# EAGLE schematic nervous_system (EAGLE 8.4.1)
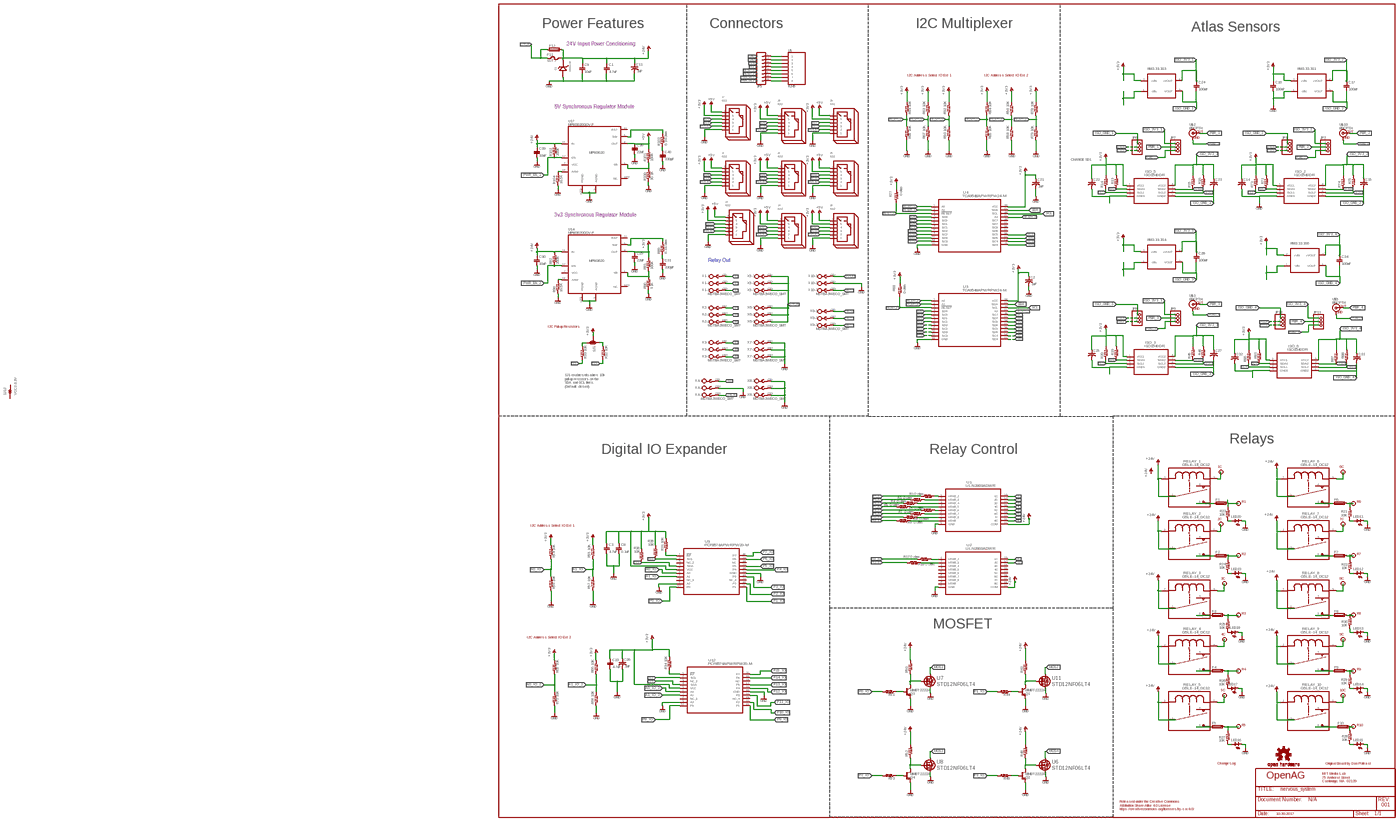
[diagram p0: schematic, sheet 1, overview]
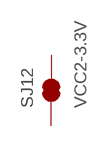
[diagram p1: schematic, sheet 1, part 1 of 5]
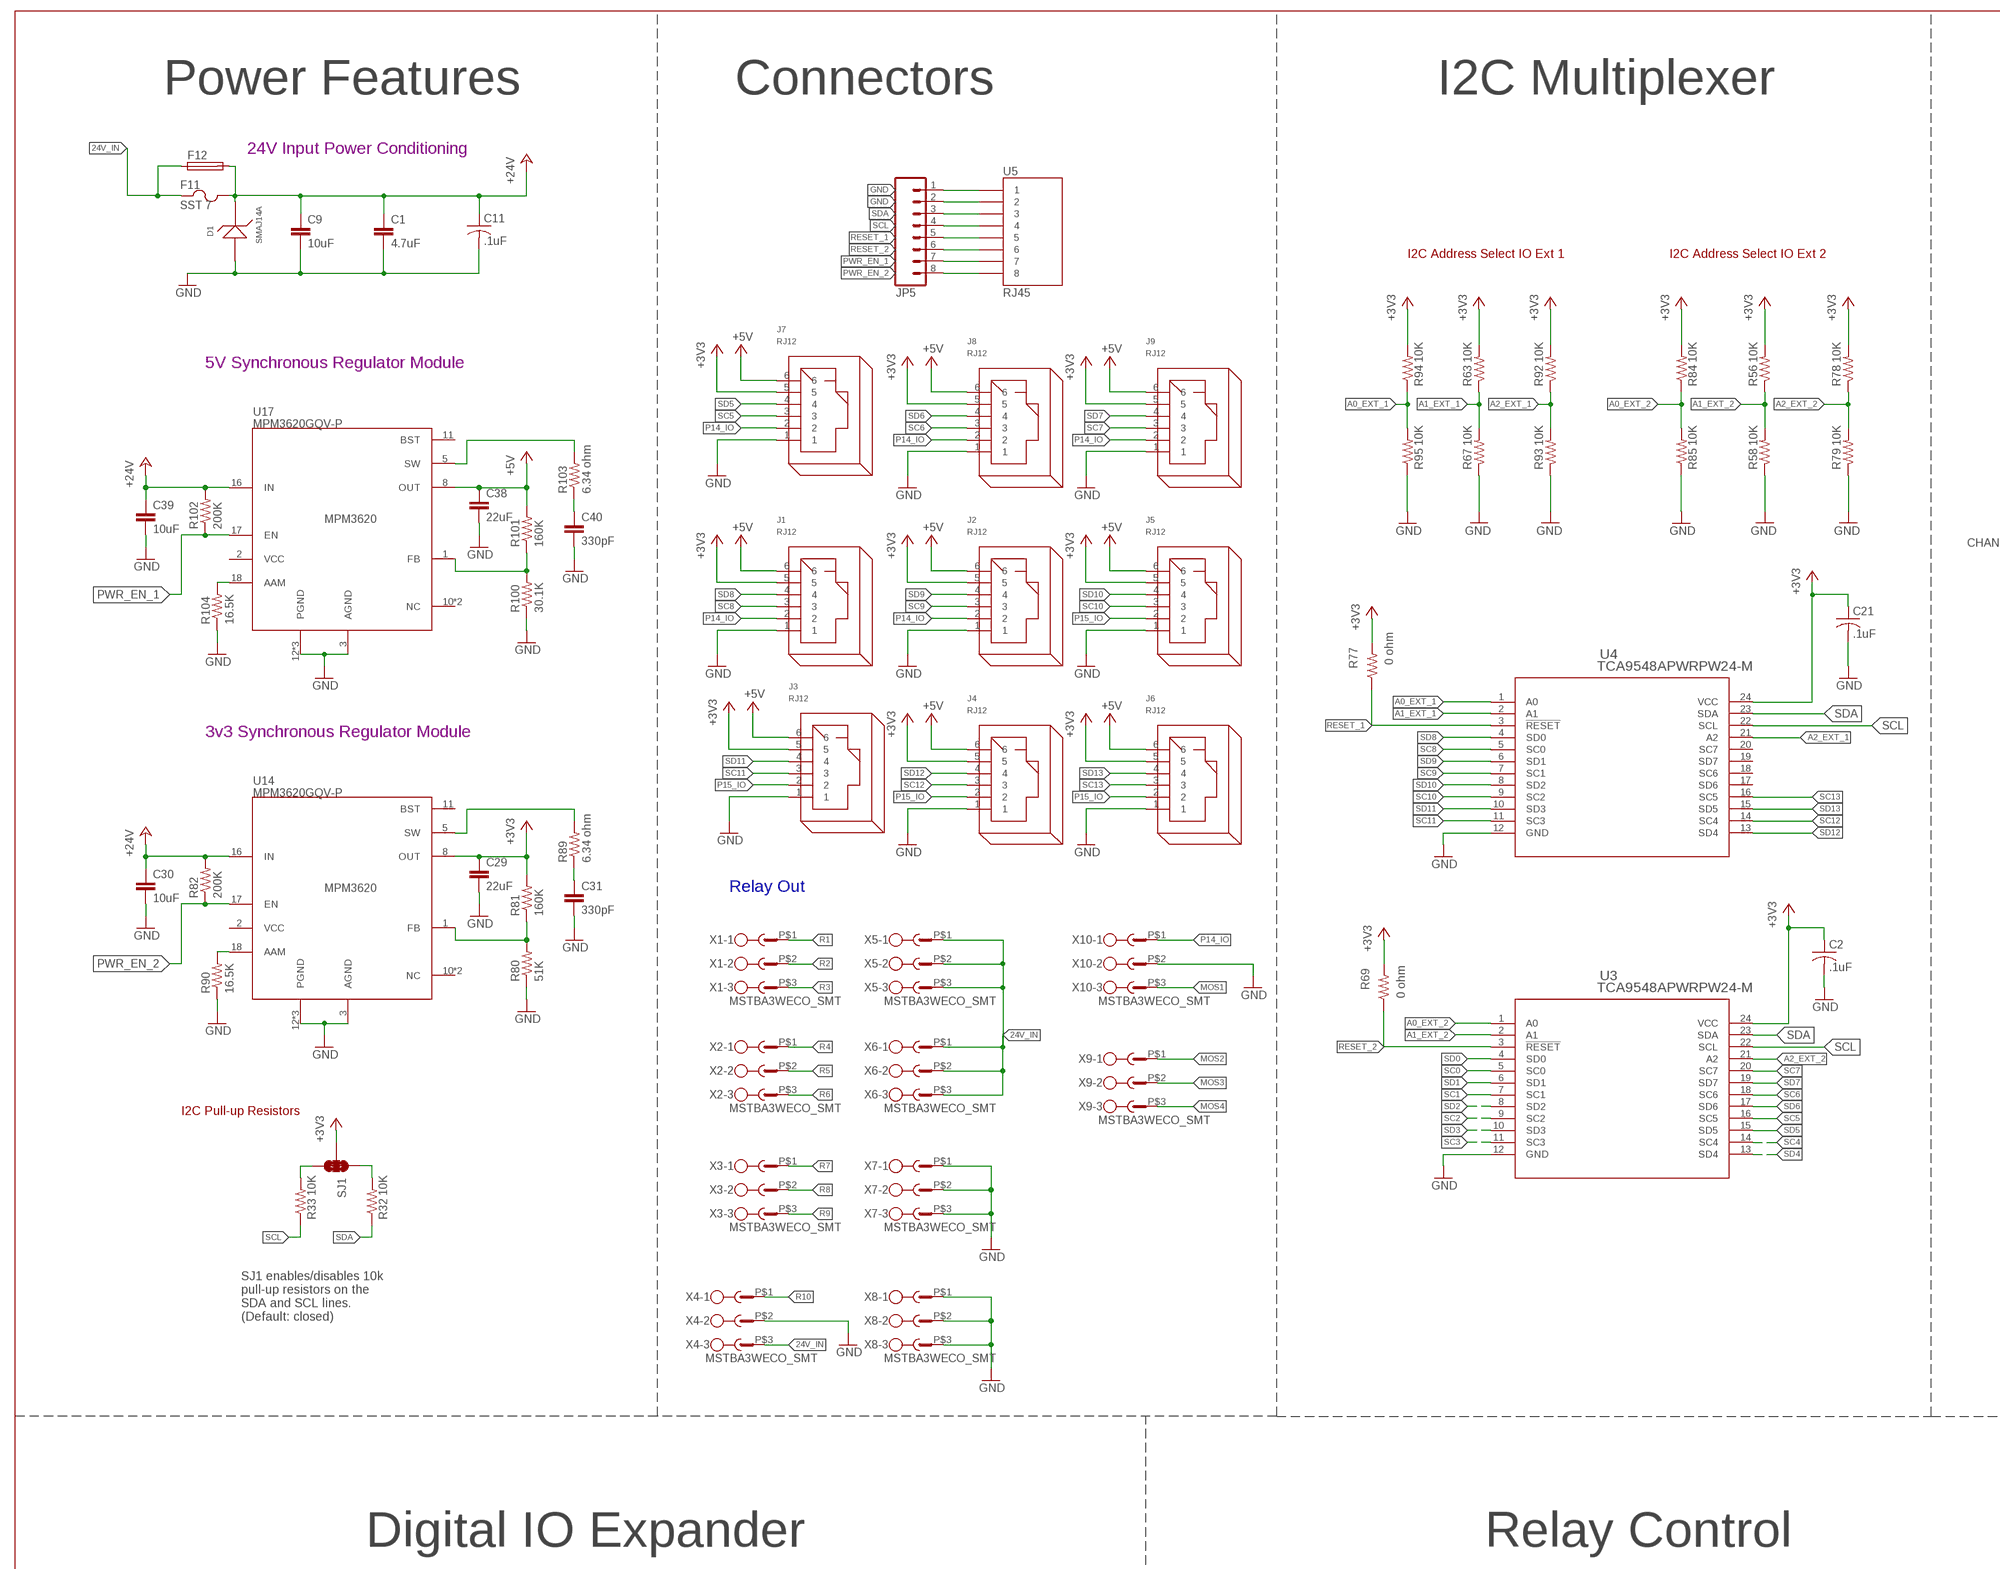
[diagram p2: schematic, sheet 1, part 2 of 5]
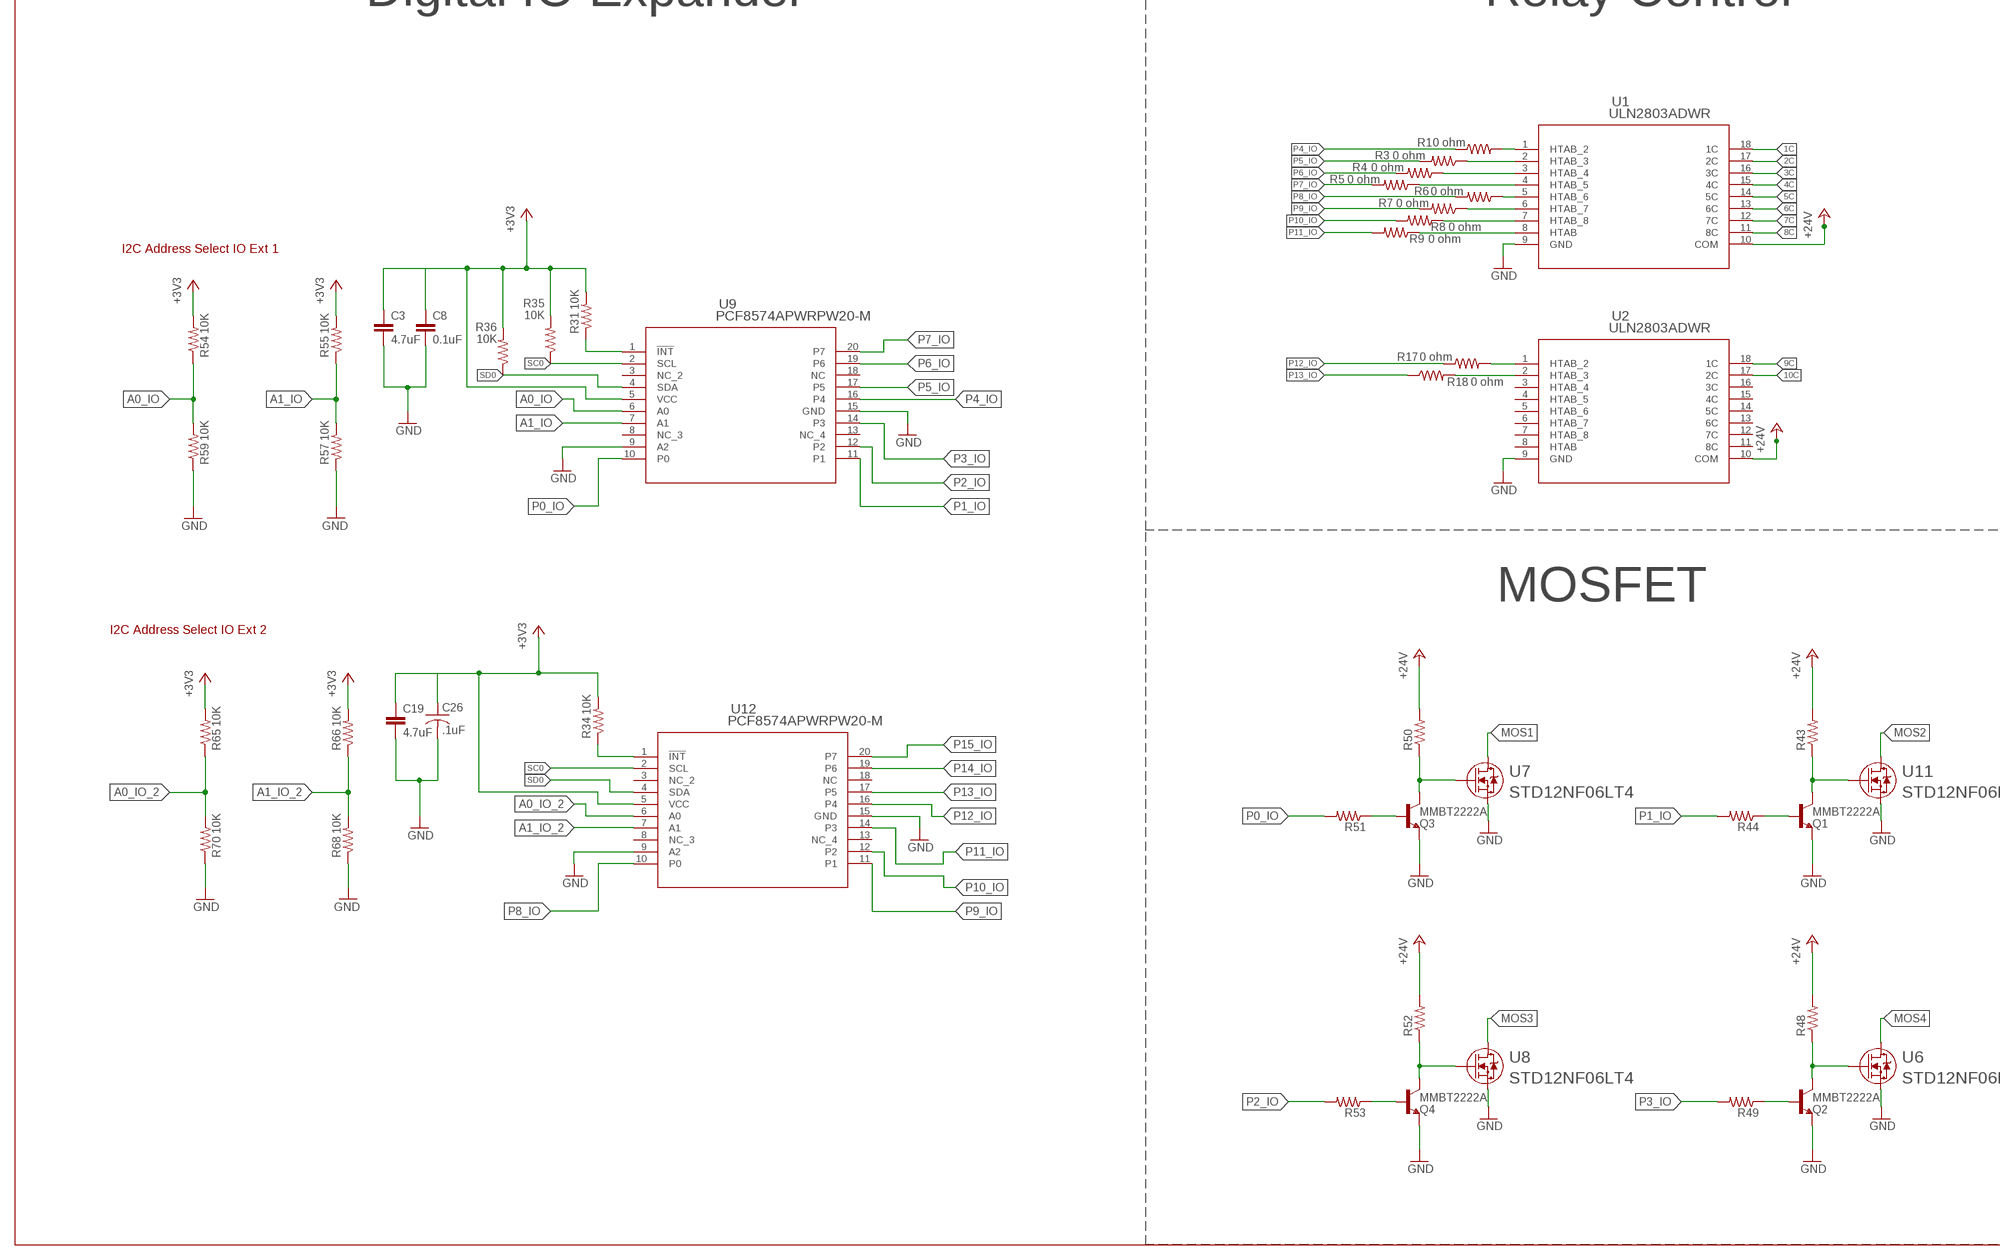
[diagram p3: schematic, sheet 1, part 3 of 5]
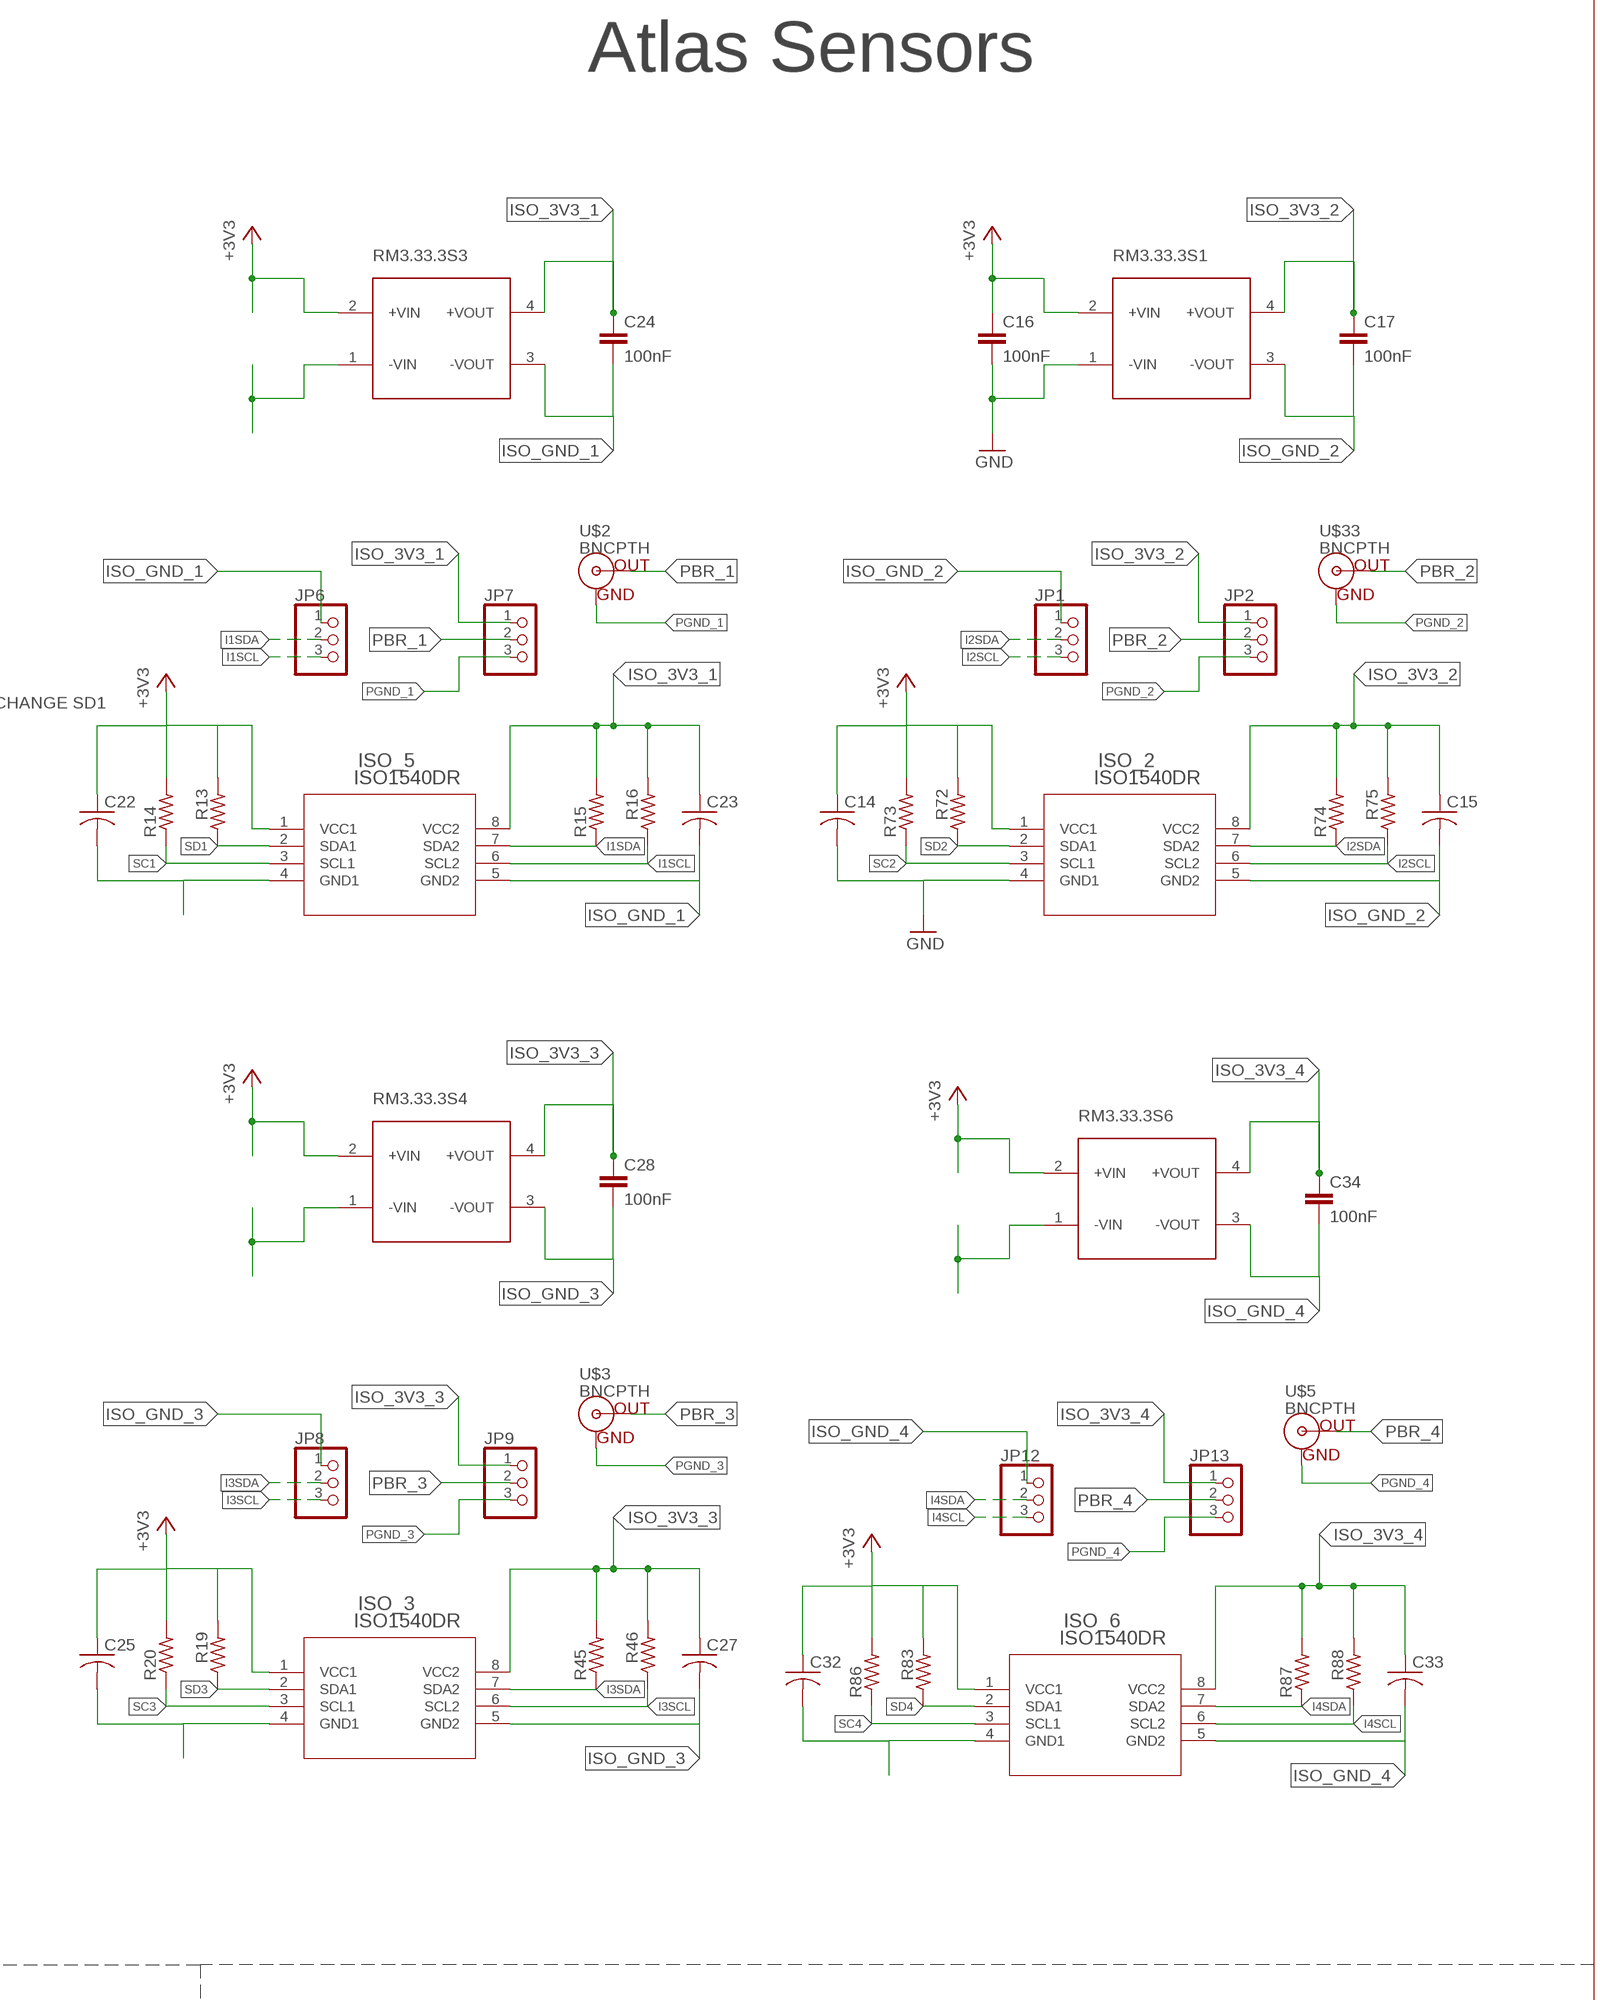
[diagram p4: schematic, sheet 1, part 4 of 5]
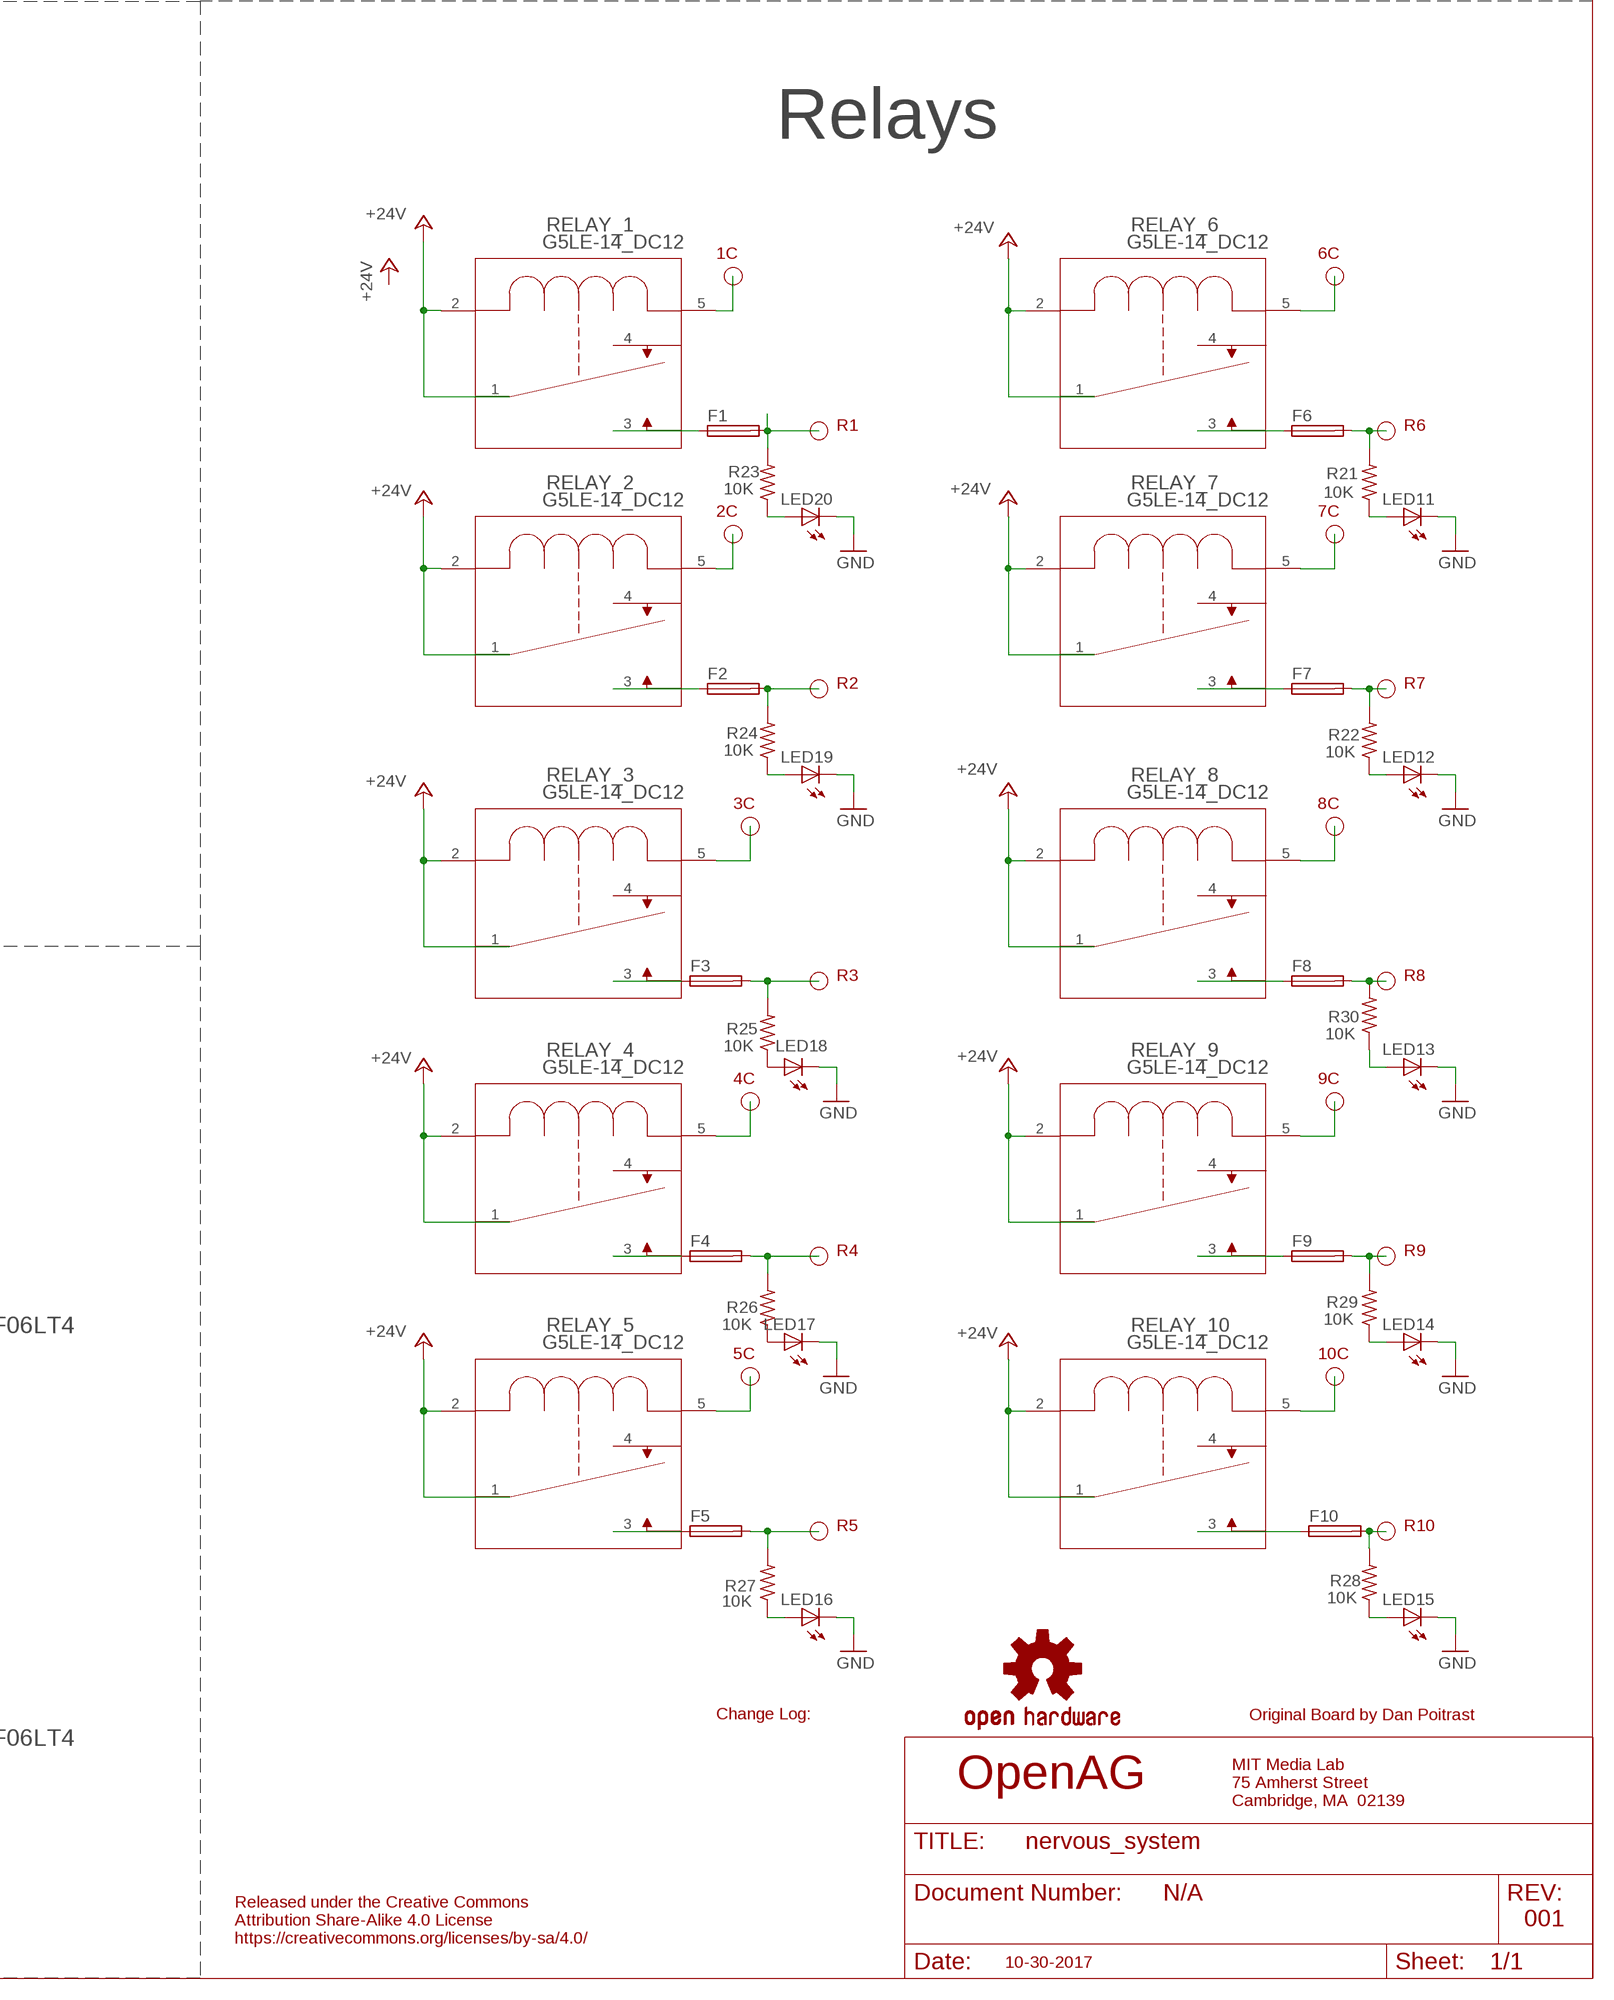
[diagram p5: schematic, sheet 1, part 5 of 5]

## Parts
C1  4.7uF  4.7UF-C1206C475K5PACTU  [CAP_C1206]
C2  .1uF  C-USC0603  [C0603@1]
C3  4.7uF  4.7UF-C1206C475K5PACTU  [CAP_C1206]
C8  0.1uF  0.1UF-C1206C104K5RAC7867  [C1206C]
C9  10uF  10UF-CL31B106KBHNNNE  [C1206]
C11  .1uF  C-USC0603  [C0603@1]
C14  C-USC0603  [C0603]
C15  C-USC0603  [C0603]
C16  100nF  CAP0805  [0805@1]
C17  100nF  CAP0805  [0805@1]
C19  4.7uF  4.7UF-C1206C475K5PACTU  [CAP_C1206]
C21  .1uF  C-USC0603  [C0603@1]
C22  C-USC0603  [C0603]
C23  C-USC0603  [C0603]
C24  100nF  CAP0805  [0805@1]
C25  C-USC0603  [C0603]
C26  .1uF  C-USC0603  [C0603@1]
C27  C-USC0603  [C0603]
C28  100nF  CAP0805  [0805@1]
C29  22uF  22UF-C3216X5R1V226M160AC  [C1206]
C30  10uF  10UF-CL31B106KBHNNNE  [C1206]
C31  330pF  330PF-CL10B331KB8NNNC  [C0603]
C32  C-USC0603  [C0603]
C33  C-USC0603  [C0603]
C34  100nF  CAP0805  [0805@1]
C38  22uF  22UF-C3216X5R1V226M160AC  [C1206]
C39  10uF  10UF-CL31B106KBHNNNE  [C1206]
C40  330pF  330PF-CL10B331KB8NNNC  [C0603]
D1  SMAJ14A  [DO-214AC]
F1  GSH15  [GSH15]
F2  GSH15  [GSH15]
F3  GSH15  [GSH15]
F4  GSH15  [GSH15]
F5  GSH15  [GSH15]
F6  GSH15  [GSH15]
F7  GSH15  [GSH15]
F8  GSH15  [GSH15]
F9  GSH15  [GSH15]
F10  GSH15  [GSH15]
F11  SST 7  SST_7  [SS]
F12  GSH15  [GSH15]
ISO_2  ISO1540DR  [D8]
ISO_3  ISO1540DR  [D8]
ISO_5  ISO1540DR  [D8]
ISO_6  ISO1540DR  [D8]
J1  RJ12  [RJ12]
J2  RJ12  [RJ12]
J3  RJ12  [RJ12]
J4  RJ12  [RJ12]
J5  RJ12  [RJ12]
J6  RJ12  [RJ12]
J7  RJ12  [RJ12]
J8  RJ12  [RJ12]
J9  RJ12  [RJ12]
JP1  PINHD-1X3  [1X03]
JP2  PINHD-1X3  [1X03]
JP5  M08  [1X08]
JP6  PINHD-1X3  [1X03]
JP7  PINHD-1X3  [1X03]
JP8  PINHD-1X3  [1X03]
JP9  PINHD-1X3  [1X03]
JP12  PINHD-1X3  [1X03]
JP13  PINHD-1X3  [1X03]
LED11  LED  [SMARTLED-TTW]
LED12  LED  [SMARTLED-TTW]
LED13  LED  [SMARTLED-TTW]
LED14  LED  [SMARTLED-TTW]
LED15  LED  [SMARTLED-TTW]
LED16  LED  [SMARTLED-TTW]
LED17  LED  [SMARTLED-TTW]
LED18  LED  [SMARTLED-TTW]
LED19  LED  [SMARTLED-TTW]
LED20  LED  [SMARTLED-TTW]
LOGO3  OSHW-LOGOS  [OSHW-LOGO-S]
Q1  MMBT2222A  BCF30SMD  [SOT23-BEC]
Q2  MMBT2222A  BCF30SMD  [SOT23-BEC]
Q3  MMBT2222A  BCF30SMD  [SOT23-BEC]
Q4  MMBT2222A  BCF30SMD  [SOT23-BEC]
R1  0 ohm  R-US_R0603  [R0603]
R3  0 ohm  R-US_R0603  [R0603]
R4  0 ohm  R-US_R0603  [R0603]
R5  0 ohm  R-US_R0603  [R0603]
R6  0 ohm  R-US_R0603  [R0603]
R7  0 ohm  R-US_R0603  [R0603]
R8  0 ohm  R-US_R0603  [R0603]
R9  0 ohm  R-US_R0603  [R0603]
R13  R-US_R0603  [R0603]
R14  R-US_R0603  [R0603]
R15  R-US_R0603  [R0603]
R16  R-US_R0603  [R0603]
R17  0 ohm  R-US_R0603  [R0603]
R18  0 ohm  R-US_R0603  [R0603]
R19  R-US_R0603  [R0603]
R20  R-US_R0603  [R0603]
R21  10K  R-US_R0603  [R0603]
R22  10K  R-US_R0603  [R0603]
R23  10K  R-US_R0603  [R0603]
R24  10K  R-US_R0603  [R0603]
R25  10K  R-US_R0603  [R0603]
R26  10K  R-US_R0603  [R0603]
R27  10K  R-US_R0603  [R0603]
R28  10K  R-US_R0603  [R0603]
R29  10K  R-US_R0603  [R0603]
R30  10K  R-US_R0603  [R0603]
R31  10K  10KOHM-1/10W-1%(0603)0603  [0603-RES]
R32  10K  10KOHM-1/10W-1%(0603)0603  [0603-RES]
R33  10K  10KOHM-1/10W-1%(0603)0603  [0603-RES]
R34  10K  10KOHM-1/10W-1%(0603)0603  [0603-RES]
R35  10K  10KOHM-1/10W-1%(0603)0603  [0603-RES]
R36  10K  10KOHM-1/10W-1%(0603)0603  [0603-RES]
R43  R-US_R0805W  [R0805W]
R44  R-US_R0805W  [R0805W]
R45  R-US_R0603  [R0603]
R46  R-US_R0603  [R0603]
R48  R-US_R0805W  [R0805W]
R49  R-US_R0805W  [R0805W]
R50  R-US_R0805W  [R0805W]
R51  R-US_R0805W  [R0805W]
R52  R-US_R0805W  [R0805W]
R53  R-US_R0805W  [R0805W]
R54  10K  10KOHM-1/10W-1%(0603)0603  [0603-RES]
R55  10K  10KOHM-1/10W-1%(0603)0603  [0603-RES]
R56  10K  10KOHM-1/10W-1%(0603)0603  [0603-RES]
R57  10K  10KOHM-1/10W-1%(0603)0603  [0603-RES]
R58  10K  10KOHM-1/10W-1%(0603)0603  [0603-RES]
R59  10K  10KOHM-1/10W-1%(0603)0603  [0603-RES]
R63  10K  10KOHM-1/10W-1%(0603)0603  [0603-RES]
R65  10K  10KOHM-1/10W-1%(0603)0603  [0603-RES]
R66  10K  10KOHM-1/10W-1%(0603)0603  [0603-RES]
R67  10K  10KOHM-1/10W-1%(0603)0603  [0603-RES]
R68  10K  10KOHM-1/10W-1%(0603)0603  [0603-RES]
R69  0 ohm  R-US_R0603  [R0603]
R70  10K  10KOHM-1/10W-1%(0603)0603  [0603-RES]
R72  R-US_R0603  [R0603]
R73  R-US_R0603  [R0603]
R74  R-US_R0603  [R0603]
R75  R-US_R0603  [R0603]
R77  0 ohm  R-US_R0603  [R0603]
R78  10K  10KOHM-1/10W-1%(0603)0603  [0603-RES]
R79  10K  10KOHM-1/10W-1%(0603)0603  [0603-RES]
R80  51K  51K-RC0603JR-0751KL  [RC0603N]
R81  160K  160K-RC0603JR-07160KL  [RC0603N]
R82  200K  200K-RC0603JR-07200KL  [RC0603N]
R83  R-US_R0603  [R0603]
R84  10K  10KOHM-1/10W-1%(0603)0603  [0603-RES]
R85  10K  10KOHM-1/10W-1%(0603)0603  [0603-RES]
R86  R-US_R0603  [R0603]
R87  R-US_R0603  [R0603]
R88  R-US_R0603  [R0603]
R89  6.34 ohm  6.3OHM-RC0805FR-076R34L  [R0805]
R90  16.5K  16.5K-311-16.5KHRCT-ND  [RC0603N]
R92  10K  10KOHM-1/10W-1%(0603)0603  [0603-RES]
R93  10K  10KOHM-1/10W-1%(0603)0603  [0603-RES]
R94  10K  10KOHM-1/10W-1%(0603)0603  [0603-RES]
R95  10K  10KOHM-1/10W-1%(0603)0603  [0603-RES]
R100  30.1K  51K-RC0603JR-0751KL  [RC0603N]
R101  160K  160K-RC0603JR-07160KL  [RC0603N]
R102  200K  200K-RC0603JR-07200KL  [RC0603N]
R103  6.34 ohm  6.3OHM-RC0805FR-076R34L  [R0805]
R104  16.5K  16.5K-311-16.5KHRCT-ND  [RC0603N]
RELAY_1  G5LE-14_DC12  [RELAY_G5LE-1]
RELAY_2  G5LE-14_DC12  [RELAY_G5LE-1]
RELAY_3  G5LE-14_DC12  [RELAY_G5LE-1]
RELAY_4  G5LE-14_DC12  [RELAY_G5LE-1]
RELAY_5  G5LE-14_DC12  [RELAY_G5LE-1]
RELAY_6  G5LE-14_DC12  [RELAY_G5LE-1]
RELAY_7  G5LE-14_DC12  [RELAY_G5LE-1]
RELAY_8  G5LE-14_DC12  [RELAY_G5LE-1]
RELAY_9  G5LE-14_DC12  [RELAY_G5LE-1]
RELAY_10  G5LE-14_DC12  [RELAY_G5LE-1]
RM3.33.3S1  ROE-0505S  [SIP4]
RM3.33.3S3  ROE-0505S  [SIP4]
RM3.33.3S4  ROE-0505S  [SIP4]
RM3.33.3S6  ROE-0505S  [SIP4]
SJ1  JUMPER-PAD-3-NC_BY_TRACE  [PAD-JUMPER-3-3OF3_NC_BY_TRACE_YES_SILK_FULL_BOX]
SJ12  VCC2-3.3V  JUMPER-PAD-2-NC_BY_TRACE  [PAD-JUMPER-2-NC_BY_TRACE_YES_SILK]
U1  ULN2803ADWR  [DW18]
U2  ULN2803ADWR  [DW18]
U3  TCA9548APWRPW24-M  [PW24-M]
U4  TCA9548APWRPW24-M  [PW24-M]
U5  RJ45  RJ45-8PTH  [RJ45-8]
U6  STD12NF06LT4  [DPAK]
U7  STD12NF06LT4  [DPAK]
U8  STD12NF06LT4  [DPAK]
U9  PCF8574APWRPW20-M  [PW20-M]
U11  STD12NF06LT4  [DPAK]
U12  PCF8574APWRPW20-M  [PW20-M]
U14  MPM3620GQV-P  [20-POWERLFQFN-MODULE]
U17  MPM3620GQV-P  [20-POWERLFQFN-MODULE]
U$2  BNCPTH  [BNC]
U$3  BNCPTH  [BNC]
U$5  BNCPTH  [BNC]
U$33  BNCPTH  [BNC]
X1  MSTBA3WECO_SMT  [WECO_3POS_SMT]
X2  MSTBA3WECO_SMT  [WECO_3POS_SMT]
X3  MSTBA3WECO_SMT  [WECO_3POS_SMT]
X4  MSTBA3WECO_SMT  [WECO_3POS_SMT]
X5  MSTBA3WECO_SMT  [WECO_3POS_SMT]
X6  MSTBA3WECO_SMT  [WECO_3POS_SMT]
X7  MSTBA3WECO_SMT  [WECO_3POS_SMT]
X8  MSTBA3WECO_SMT  [WECO_3POS_SMT]
X9  MSTBA3WECO_SMT  [WECO_3POS_SMT]
X10  MSTBA3WECO_SMT  [WECO_3POS_SMT]

## Nets
1C: RELAY_1.5 U1.18(1C)
2C: RELAY_2.5 U1.17(2C)
3C: RELAY_3.5 U1.16(3C)
4C: RELAY_4.5 U1.15(4C)
5C: RELAY_5.5 U1.14(5C)
6C: RELAY_6.5 U1.13(6C)
7C: RELAY_7.5 U1.12(7C)
8C: RELAY_8.5 U1.11(8C)
9C: RELAY_9.5 U2.18(1C)
10C: RELAY_10.5 U2.17(2C)
24V_IN: F11.1 F12.1 X4.P$3 X5.P$1 X5.P$2 X5.P$3 X6.P$1 X6.P$2 X6.P$3
+3V3: C2.1 C3.1 C8.1 C14.1 C16.1 C19.1 C21.1 C22.1 C25.1 C26.1 C29.1 C32.1 ISO_2.1(VCC1) ISO_3.1(VCC1) ISO_5.1(VCC1) ISO_6.1(VCC1) J1.5 J2.5 J3.5 J4.5 J5.5 J6.5 J7.5 J8.5 J9.5 R13.2 R14.2 R19.2 R20.2 R31.2 R34.2 R35.2 R36.2 R54.2 R55.2 R56.2 R63.2 R65.2 R66.2 R69.2 R72.2 R73.2 R77.2 R78.2 R81.2 R83.2 R84.2 R86.2 R92.2 R94.2 RM3.33.3S1.2(+VIN) RM3.33.3S3.2(+VIN) RM3.33.3S4.2(+VIN) RM3.33.3S6.2(+VIN) SJ1.2 U3.24(VCC) U4.24(VCC) U9.5(VCC) U12.5(VCC) U14.8(OUT)
+5V: C38.1 J1.6 J2.6 J3.6 J4.6 J5.6 J6.6 J7.6 J8.6 J9.6 R101.2 U17.8(OUT)
+24V: C1.1 C9.1 C11.1 C30.1 C39.1 D1.C F11.2 F12.2 R43.2 R48.2 R50.2 R52.2 R82.2 R102.2 RELAY_1.1 RELAY_1.2 RELAY_2.1 RELAY_2.2 RELAY_3.1 RELAY_3.2 RELAY_4.1 RELAY_4.2 RELAY_5.1 RELAY_5.2 RELAY_6.1 RELAY_6.2 RELAY_7.1 RELAY_7.2 RELAY_8.1 RELAY_8.2 RELAY_9.1 RELAY_9.2 RELAY_10.1 RELAY_10.2 U1.10(COM) U2.10(COM) U14.16(IN) U17.16(IN)
A0_EXT_1: R94.1 R95.2 U4.1(A0)
A0_EXT_2: R84.1 R85.2 U3.1(A0)
A0_IO: R54.1 R59.2 U9.6(A0)
A0_IO_2: R65.1 R70.2 U12.6(A0)
A1_EXT_1: R63.1 R67.2 U4.2(A1)
A1_EXT_2: R56.1 R58.2 U3.2(A1)
A1_IO: R55.1 R57.2 U9.7(A1)
A1_IO_2: R66.1 R68.2 U12.7(A1)
A2_EXT_1: R92.1 R93.2 U4.21(A2)
A2_EXT_2: R78.1 R79.2 U3.21(A2)
GND: C1.2 C2.2 C3.2 C8.2 C9.2 C11.2 C14.2 C16.2 C19.2 C21.2 C22.2 C25.2 C26.2 C29.2 C30.2 C31.2 C32.2 C38.2 C39.2 C40.2 D1.A ISO_2.4(GND1) ISO_3.4(GND1) ISO_5.4(GND1) ISO_6.4(GND1) J1.1 J2.1 J3.1 J4.1 J5.1 J6.1 J7.1 J8.1 J9.1 JP5.1 JP5.2 LED11.C@1(C) LED12.C@1(C) LED13.C@1(C) LED14.C@1(C) LED15.C@1(C) LED16.C@1(C) LED17.C@1(C) LED18.C@1(C) LED19.C@1(C) LED20.C@1(C) Q1.E Q2.E Q3.E Q4.E R57.1 R58.1 R59.1 R67.1 R68.1 R70.1 R79.1 R80.1 R85.1 R90.1 R93.1 R95.1 R100.1 R104.1 RM3.33.3S1.1(-VIN) RM3.33.3S3.1(-VIN) RM3.33.3S4.1(-VIN) RM3.33.3S6.1(-VIN) U1.9(GND) U2.9(GND) U3.12(GND) U4.12(GND) U5.1 U5.2 U6.2 U7.2 U8.2 U9.9(A2) U9.15(GND) U11.2 U12.9(A2) U12.15(GND) U14.3(AGND) U14.12(PGND) U14.13(PGND) U14.14(PGND) U17.3(AGND) U17.12(PGND) U17.13(PGND) U17.14(PGND) X4.P$2 X7.P$1 X7.P$2 X7.P$3 X8.P$1 X8.P$2 X8.P$3 X10.P$2
I1SCL: ISO_5.6(SCL2) JP6.3 R16.1
I1SDA: ISO_5.7(SDA2) JP6.2 R15.1
I2SCL: ISO_2.6(SCL2) JP1.3 R75.1
I2SDA: ISO_2.7(SDA2) JP1.2 R74.1
I3SCL: ISO_3.6(SCL2) JP8.3 R46.1
I3SDA: ISO_3.7(SDA2) JP8.2 R45.1
I4SCL: ISO_6.6(SCL2) JP12.3 R88.1
I4SDA: ISO_6.7(SDA2) JP12.2 R87.1
ISO_3V3_1: C23.1 C24.1 ISO_5.8(VCC2) JP7.1 R15.2 R16.2 RM3.33.3S3.4(+VOUT)
ISO_3V3_2: C15.1 C17.1 ISO_2.8(VCC2) JP2.1 R74.2 R75.2 RM3.33.3S1.4(+VOUT)
ISO_3V3_3: C27.1 C28.1 ISO_3.8(VCC2) JP9.1 R45.2 R46.2 RM3.33.3S4.4(+VOUT)
ISO_3V3_4: C33.1 C34.1 ISO_6.8(VCC2) JP13.1 R87.2 R88.2 RM3.33.3S6.4(+VOUT)
ISO_GND_1: C23.2 C24.2 ISO_5.5(GND2) JP6.1 RM3.33.3S3.3(-VOUT)
ISO_GND_2: C15.2 C17.2 ISO_2.5(GND2) JP1.1 RM3.33.3S1.3(-VOUT)
ISO_GND_3: C27.2 C28.2 ISO_3.5(GND2) JP8.1 RM3.33.3S4.3(-VOUT)
ISO_GND_4: C33.2 C34.2 ISO_6.5(GND2) JP12.1 RM3.33.3S6.3(-VOUT)
MOS1: U7.3 X10.P$3
MOS2: U11.3 X9.P$1
MOS3: U8.3 X9.P$2
MOS4: U6.3 X9.P$3
N$1: R1.2 U1.1(HTAB_2)
N$3: R3.1 U1.2(HTAB_3)
N$4: R4.1 U1.3(HTAB_4)
N$5: R5.1 U1.4(HTAB_5)
N$6: R6.1 U1.5(HTAB_6)
N$7: R7.1 U1.6(HTAB_7)
N$8: R8.1 U1.7(HTAB_8)
N$9: R9.1 U1.8(HTAB)
N$10: F10.1 RELAY_10.3
N$11: F9.1 RELAY_9.3
N$13: F8.1 RELAY_8.3
N$15: F7.1 RELAY_7.3
N$16: R80.2 R81.1 U14.1(FB)
N$19: R89.2 U14.5(SW)
N$20: C31.1 R89.1
N$21: R90.2 U14.18(AAM)
N$25: F6.1 RELAY_6.3
N$27: F1.1 RELAY_1.3
N$29: F2.1 RELAY_2.3
N$31: F3.1 RELAY_3.3
N$33: F4.1 RELAY_4.3
N$34: R100.2 R101.1 U17.1(FB)
N$35: F5.1 RELAY_5.3
N$36: R103.2 U17.5(SW)
N$37: Q1.C R43.1 U11.1
N$38: Q1.B R44.1
N$39: C40.1 R103.1
N$40: R104.2 U17.18(AAM)
N$41: Q2.C R48.1 U6.1
N$42: Q2.B R49.1
N$45: Q3.C R50.1 U7.1
N$46: Q3.B R51.1
N$47: R17.2 U2.1(HTAB_2)
N$48: R18.2 U2.2(HTAB_3)
N$49: R34.1 U12.1(!INT)
N$53: LED11.A@1(A) R21.1
N$54: LED12.A@1(A) R22.1
N$55: LED16.A@1(A) R27.1
N$56: LED17.A@1(A) R26.1
N$57: LED18.A@1(A) R25.1
N$58: LED20.A@1(A) R23.1
N$59: LED19.A@1(A) R24.1
N$60: LED13.A@1(A) R30.1
N$61: LED14.A@1(A) R29.1
N$62: LED15.A@1(A) R28.1
N$63: Q4.C R52.1 U8.1
N$64: Q4.B R53.1
N$65: R31.1 U9.1(!INT)
N$66: R33.2 SJ1.3
N$67: R32.2 SJ1.1
P0_IO: R51.2 U9.10(P0)
P1_IO: R44.2 U9.11(P1)
P2_IO: R53.2 U9.12(P2)
P3_IO: R49.2 U9.14(P3)
P4_IO: R1.1 U9.16(P4)
P5_IO: R3.2 U9.17(P5)
P6_IO: R4.2 U9.19(P6)
P7_IO: R5.2 U9.20(P7)
P8_IO: R6.2 U12.10(P0)
P9_IO: R7.2 U12.11(P1)
P10_IO: R8.2 U12.12(P2)
P11_IO: R9.2 U12.14(P3)
P12_IO: R17.1 U12.16(P4)
P13_IO: R18.1 U12.17(P5)
P14_IO: J1.2 J2.2 J7.2 J8.2 J9.2 U12.19(P6) X10.P$1
P15_IO: J3.2 J4.2 J5.2 J6.2 U12.20(P7)
PBR_1: JP7.2 U$2.S(OUT)
PBR_2: JP2.2 U$33.S(OUT)
PBR_3: JP9.2 U$3.S(OUT)
PBR_4: JP13.2 U$5.S(OUT)
PGND_1: JP7.3 U$2.GND
PGND_2: JP2.3 U$33.GND
PGND_3: JP9.3 U$3.GND
PGND_4: JP13.3 U$5.GND
PWR_EN_1: JP5.7 R102.1 U5.7 U17.17(EN)
PWR_EN_2: JP5.8 R82.1 U5.8 U14.17(EN)
R1: F1.2 R23.2 X1.P$1
R2: F2.2 R24.2 X1.P$2
R3: F3.2 R25.2 X1.P$3
R4: F4.2 R26.2 X2.P$1
R5: F5.2 R27.2 X2.P$2
R6: F6.2 R21.2 X2.P$3
R7: F7.2 R22.2 X3.P$1
R8: F8.2 R30.2 X3.P$2
R9: F9.2 R29.2 X3.P$3
R10: F10.2 R28.2 X4.P$1
RESET_1: JP5.5 R77.1 U4.3(!RESET) U5.5
RESET_2: JP5.6 R69.1 U3.3(!RESET) U5.6
SC0: R35.1 U3.5(SC0) U9.2(SCL) U12.2(SCL)
SC1: ISO_5.3(SCL1) R14.1 U3.7(SC1)
SC2: ISO_2.3(SCL1) R73.1 U3.9(SC2)
SC3: ISO_3.3(SCL1) R20.1 U3.11(SC3)
SC4: ISO_6.3(SCL1) R86.1 U3.14(SC4)
SC5: J7.3 U3.16(SC5)
SC6: J8.3 U3.18(SC6)
SC7: J9.3 U3.20(SC7)
SC8: J1.3 U4.5(SC0)
SC9: J2.3 U4.7(SC1)
SC10: J5.3 U4.9(SC2)
SC11: J3.3 U4.11(SC3)
SC12: J4.3 U4.14(SC4)
SC13: J6.3 U4.16(SC5)
SCL: JP5.4 R33.1 U3.22(SCL) U4.22(SCL) U5.4
SD0: R36.1 U3.4(SD0) U9.4(SDA) U12.4(SDA)
SD1: ISO_5.2(SDA1) R13.1 U3.6(SD1)
SD2: ISO_2.2(SDA1) R72.1 U3.8(SD2)
SD3: ISO_3.2(SDA1) R19.1 U3.10(SD3)
SD4: ISO_6.2(SDA1) R83.1 U3.13(SD4)
SD5: J7.4 U3.15(SD5)
SD6: J8.4 U3.17(SD6)
SD7: J9.4 U3.19(SD7)
SD8: J1.4 U4.4(SD0)
SD9: J2.4 U4.6(SD1)
SD10: J5.4 U4.8(SD2)
SD11: J3.4 U4.10(SD3)
SD12: J4.4 U4.13(SD4)
SD13: J6.4 U4.15(SD5)
SDA: JP5.3 R32.1 U3.23(SDA) U4.23(SDA) U5.3
Unconnected: RELAY_1.4 RELAY_2.4 RELAY_3.4 RELAY_4.4 RELAY_5.4 RELAY_6.4 RELAY_7.4 RELAY_8.4 RELAY_9.4 RELAY_10.4 SJ12.1 SJ12.2 U2.11(8C) U2.12(7C) U2.13(6C) U2.14(5C) U2.15(4C) U2.16(3C) U4.17(SD6) U4.18(SC6) U4.19(SD7) U4.20(SC7) U9.3(NC_2) U9.8(NC_3) U9.13(NC_4) U9.18(NC) U12.3(NC_2) U12.8(NC_3) U12.13(NC_4) U12.18(NC) U14.2(VCC) U14.10(NC) U14.11(BST) U14.15(NC) U17.2(VCC) U17.10(NC) U17.11(BST) U17.15(NC)

## Notes on the sheet
- Power Features | Connectors | I2C Multiplexer | Atlas Sensors
- 24V Input Power Conditioning
- I2C Address Select IO Ext 1 | I2C Address Select IO Ext 2
- 5V Synchronous Regulator Module
- CHANGE SD1
- 3v3 Synchronous Regulator Module
- Relay Out
- I2C Pull-up Resistors
- SJ1 enables/disables 10k
  pull-up resistors on the
  SDA and SCL lines.
  (Default: closed)
- Relays
- Digital IO Expander | Relay Control
- 1C | 6C
- R1 | R6
- 2C | 7C
- I2C Address Select IO Ext 1
- R2 | R7
- 3C | 8C
- R3 | R8
- MOSFET
- I2C Address Select IO Ext 2 | 4C | 9C
- R4 | R9
- 5C | 10C
- R5 | R10
- Original Board by Dan Poitrast
- Change Log:
- OpenAG
- MIT Media Lab
  75 Amherst Street
  Cambridge, MA  02139
- N/A
- 001
- Released under the Creative Commons
  Attribution Share-Alike 4.0 License
  https://creativecommons.org/licenses/by-sa/4.0/
- 10-30-2017

## Power pins joined to a net without a drawn wire
HTAB: U2.8(HTAB)
HTAB_4: U2.3(HTAB_4)
HTAB_5: U2.4(HTAB_5)
HTAB_6: U2.5(HTAB_6)
HTAB_7: U2.6(HTAB_7)
HTAB_8: U2.7(HTAB_8)

## Library data of the parts
C1 C3 C19 = openag-capacitors:4.7UF-C1206C475K5PACTU: Kemet - C1206C475K5PACTU - CAP CER 4.7UF 50V X5R 1206 Description: 4.7�F �10% 50V Ceramic Capacitor X5R 1206 (3216 Metric) Technical Specifications: Capacitance: 4.7uF Tolerance: ±10% Rated Voltage: 50V Temperature Coefficient: X5R Operating Temperature: -55°C ~ 85°C Package/Case: 1206 (3216 Metric) Datasheet(s): https://media.digikey.com/pdf/Data%20Sheets/Kemet%20PDFs/C1206C475K5PAC.pdf Vendor(s): Digikey: 399-5507-1-ND <https://www.digikey.com/product-detail/en/kemet/C1206C475K5PACTU/399-5507-1-ND/1950685>; POPULATE: YES; VERIFIED: NO
C2 C11 C14 C15 C21-C23 C25-C27 C32 C33 = rcl:C-US: CAPACITOR, American symbol
C8 = openag-capacitors:0.1UF-C1206C104K5RAC7867: Kemet - C1206C104K5RAC7867 - CAP CER 0.1UF 50V X7R 1206 Description: 0.1�F �10% 50V Ceramic Capacitor X7R 1206 (3216 Metric) Technical Specifications: Capacitance: 0.1uF Tolerance ±10% Rated Voltage: 50V Temperature Coefficient: X7R Operating Temperature: -55°C ~ 125°C Package / Case: 1206 (3216 Metric) Datasheet(s): X7R Dielectric, 6.3-250 VDC <https://content.kemet.com/datasheets/KEM_C1002_X7R_SMD.pdf> Vendor(s): Digikey: 399-1249-1-ND <https://www.digikey.com/product-detail/en/kemet/C1206C104K5RAC7867/399-1249-1-ND/411524>; POPULATE: YES; VERIFIED: NO
C9 C30 C39 = openag-capacitors:10UF-CL31B106KBHNNNE: Samsung - CL31B106KBHNNNE - CAP CER 10UF 50V X7R 1206 Description: 10�F �10% 50V Ceramic Capacitor X7R 1206 (3216 Metric) Technical Specifications: Capacitance: 10uF Tolerance: ±10% Rated Voltage: 50V Temperature Coefficient: X7R Operating Temperature: -55°C ~ -125°C Package/Case: 1206 (3216 Metric) Datasheet(s): CL Series, MLCC Datasheet <https://media.digikey.com/pdf/Data%20Sheets/Samsung%20PDFs/CL_Series_MLCC_ds.pdf> Vendor(s): Digikey: 1276-6767-1-ND <https://www.digikey.com/product-detail/en/samsung-electro-mechanics-america-inc/CL31B106KBHNNNE/1276-6767-1-ND/5961626>; POPULATE: YES; VERIFIED: NO
C16 C17 C24 C28 C34 = SparkFun-Capacitors:CAP: Capacitor Standard 0603 ceramic capacitor, and 0.1" leaded capacitor.
C29 C38 = openag-capacitors:22UF-C3216X5R1V226M160AC: TDK Corp - C3216X5R1V226M160AC - CAP CER 22UF 35V X5R 1206 Description: 22�F �20% 35V Ceramic Capacitor X5R 1206 (3216 Metric) Technical Specifications: Capacitance: 22�F Tolerance: �20% Rated Voltage: 35V Temperature Coefficient: X5R Operating Temperature: -55�C ~ 85�C Package / Case: 1206 (3216 Metric) Datasheet(s): C3216X5R1V226M160AC Character Sheet <https://product.tdk.com/info/en/documents/chara_sheet/C3216X5R1V226M160AC.pdf> C Series, General Datasheet <https://product.tdk.com/info/en/catalog/datasheets/mlcc_commercial_general_en.pdf> Vendor(s): Digikey: 445-8045-1-ND <https://www.digikey.com/product-detail/en/tdk-corporation/C3216X5R1V226M160AC/445-8045-1-ND/2792165>; POPULATE: YES; VERIFIED: NO
C31 C40 = openag-capacitors:330PF-CL10B331KB8NNNC: Samsung - CL10B331KB8NNNC - CAP CER 330PF 50V X7R 0603 Description: 330pF �10% 50V Ceramic Capacitor X7R 0603 (1608 Metric) Technical Specifications: Capacitance: 330pF Tolerance: �10% Rated Voltage Temperature Coefficient: X7R Operating Temperature: -55�C ~ 125�C Package / Case: 0603 (1608 Metric) Datasheet(s): CL10B331KB8NNNC Spec <http://www.samsungsem.com/kr/support/product-search/mlcc/CL10B331KB8NNNC.jsp> Vendor(s): Digikey: 1276-1787-1-ND <https://www.digikey.com/product-detail/en/samsung-electro-mechanics/CL10B331KB8NNNC/1276-1787-1-ND/3889873>; POPULATE: YES; VERIFIED: NO
D1 = openag-diodes:SMAJ14A: TVS DIODE 14VWM 23.2VC SMA - Littlefuse - SMAJ14A - SMAJ14ALFCT-ND Description: The SMAJ series is designed specifically to protect sensitive electronic equipment from voltage transients induced by lightning and other transient voltage events Technical Specifications: Type: Zener Voltage - Reverse Standoff (Typ): 14V Voltage - Breakdown (Min): 15.6V Voltage - Clamping (Max) @ Ipp: 23.2V Current - Peak Pulse (10/1000�s): 17.2A Operating Temperature: -55�C ~ 150�C (TJ) Mounting Type: Surface Mount Package / Case: DO-214AC, SMA Datasheet(s): SMAJ Series <http://www.littelfuse.com/~/media/electronics/datasheets/tvs_diodes/littelfuse_tvs_diode_smaj_datasheet.pdf.pdf> Vendor(s): Digikey: SMAJ14ALFCT-ND <https://www.digikey.com/product-detail/en/littelfuse-inc/SMAJ14A/SMAJ14ALFCT-ND/762486>; POPULATE: YES; VERIFIED: NO
F1-F10 F12 = fuse:GSH15: FUSE HOLDER grid 15mm, 19649 Wickmann; MPN: 64900001039; OC_FARNELL: 1271673; OC_NEWARK: 02P0318
F11 = openag-fuses:SST_7: Bel Fuse - SST7 - FUSE BRD MNT 7A 125VAC/VDC 2SMD Description: FUSE BRD MNT 7A 125VAC/VDC 2SMD Technical Specifications: Current Rating: 7A Voltage Rating: 125V Fuse Type: Board Mount (Cartridge Style Excluded) Mounting Type: Surface Mount Operating Temperature: -55�C ~ 125�C Datasheet(s): SST Type <https://belfuse.com/resources/StewartConnector/SST.pdf> Vendor(s): Digikey: 507-1072-1-ND <https://www.digikey.com/product-detail/en/bel-fuse-inc/SST-7/507-1072-1-ND/615026>; POPULATE: YES; VERIFIED: NO
ISO_2 ISO_3 ISO_5 ISO_6 = ISO1540:ISO1540DR; MANUFACTURER_PART_NUMBER: ISO1540DR; VENDOR: Texas Instruments
J1-J9 = con-rj:RJ12: RJ12, RJ14 and RJ25 RJ12, RJ14 and RJ25 jacks side mounted http://www.tycoelectronics.com
JP1 JP2 JP6-JP9 JP12 JP13 = pinhead:PINHD-1X3: PIN HEADER
JP5 = SparkFun:M08: Header 8 Standard 8-pin 0.1" header. Use with straight break away headers (SKU : PRT-00116), right angle break away headers (PRT-00553), swiss pins (PRT-00743), machine pins (PRT-00117), and female headers (PRT-00115).
LED11-LED20 = led:LED: LED OSRAM: - CHIPLED LG R971, LG N971, LY N971, LG Q971, LY Q971, LO R971, LY R971 LH N974, LH R974 LS Q976, LO Q976, LY Q976 LO Q996 - Hyper CHIPLED LW Q18S LB Q993, LB Q99A, LB R99A - SideLED LS A670, LO A670, LY A670, LG A670, LP A670 LB A673, LV A673, LT A673, LW A673 LH A674 LY A675 LS A676, LA A676, LO A676, LY A676, LW A676 LS A679, LY A679, LG A679 - Hyper Micro SIDELED® LS Y876, LA Y876, LO Y876, LY Y876 LT Y87S - SmartLED LW L88C, LW L88S LB L89C, LB L89S, LG L890 LS L89K, LO L89K, LY L89K LS L896, LA L896, LO L896, LY L896 - TOPLED LS T670, LO T670, LY T670, LG T670, LP T670 LSG T670, LSP T670, LSY T670, LOP T670, LYG T670 LG T671, LOG T671, LSG T671 LB T673, LV T673, LT T673, LW T673 LH T674 LS T676, LA T676, LO T676, LY T676, LB T676, LH T676, LSB T676, LW T676 LB T67C, LV T67C, LT T67C, LS T67K, LO T67K, LY T67K, LW E67C LS E67B, LA E67B, LO E67B, LY E67B, LB E67C, LV E67C, LT E67C LW T67C LS T679, LY T679, LG T679 LS T770, LO T770, LY T770, LG T770, LP T770 LB T773, LV T773, LT T773, LW T773 LH T774 LS E675, LA E675, LY E675, LS T675 LS T776, LA T776, LO T776, LY T776, LB T776 LHGB T686 LT T68C, LB T68C - Hyper Mini TOPLED® LB M676 - Mini TOPLED Santana® LG M470 LS M47K, LO M47K, LY M47K Source: http://www.osram.convergy.de LUXEON: - LUMILED® LXK2-PW12-R00, LXK2-PW12-S00, LXK2-PW14-U00, LXK2-PW14-V00 LXK2-PM12-R00, LXK2-PM12-S00, LXK2-PM14-U00 LXK2-PE12-Q00, LXK2-PE12-R00, LXK2-PE12-S00, LXK2-PE14-T00, LXK2-PE14-U00 LXK2-PB12-K00, LXK2-PB12-L00, LXK2-PB12-M00, LXK2-PB14-N00, LXK2-PB14-P00, LXK2-PB14-Q00 LXK2-PR12-L00, LXK2-PR12-M00, LXK2-PR14-Q00, LXK2-PR14-R00 LXK2-PD12-Q00, LXK2-PD12-R00, LXK2-PD12-S00 LXK2-PH12-R00, LXK2-PH12-S00 LXK2-PL12-P00, LXK2-PL12-Q00, LXK2-PL12-R00 Source: www.luxeon.com KINGBRIGHT: KA-3528ASYC Source: www.kingbright.com
LOGO3 = SparkFun-Aesthetics:OSHW-LOGO: Open-Source Hardware (OSHW) Logo This logo indicates the piece of hardware it is found on incorporates a OSHW license and/or adheres to the definition of open source hardware found here: http://freedomdefined.org/OSHW
Q1-Q4 = transistor-npn:BCF30*: NPN Transistor
R1 R3-R9 R13-R30 R43-R46 R48-R53 R69 R72-R75 R77 R83 R86-R88 = rcl:R-US_: RESISTOR, American symbol
R31-R36 R54-R59 R63 R65-R68 R70 R78 R79 R84 R85 R92-R95 = SparkFun-Resistors:10KOHM-1/10W-1%(0603): RES-00824; PROD_ID: RES-00824
R80 = openag-resistors:51K-RC0603JR-0751KL: Yageo - RC0603JR-0751KL - RES SMD 51K OHM 5% 1/10W 0603 Description: 51 kOhms �5% 0.1W, 1/10W Chip Resistor 0603 (1608 Metric) Moisture Resistant Thick Film Technical Specifications: Resistance: 51 kOhms Tolerance: �5% Power: 0.1W, 1/10W Temperature Coefficient: �100ppm/�C Operating Temperature: -55�C ~ 155�C Package / Case: 0603 (1608 Metric) Datasheet(s): RC Series, L Datasheet <http://www.yageo.com/documents/recent/PYu-RC_Group_51_RoHS_L_7.pdf> Vendor(s): Digikey: 311-51KGRCT-ND <https://www.digikey.com/product-detail/en/yageo/RC0603JR-0751KL/311-51KGRCT-ND/729751>; POPULATE: YES; VERIFIED: NO
R81 R101 = openag-resistors:160K-RC0603JR-07160KL: Yageo - RC0603JR-07160KL - RES SMD 160K OHM 5% 1/10W 0603 Description: 160 kOhms �5% 0.1W, 1/10W Chip Resistor 0603 (1608 Metric) Moisture Resistant Thick Film Technical Specifications: Resistance: 160 kOhms Tolerance: �5% Power: 0.1W, 1/10W Temperature Coefficient: �100ppm/�C Operating Temperature: -55�C ~ 155�C Package / Case: 0603 (1608 Metric) Datasheet(s): RC Series, L Datasheet Vendor(s): Digikey: 311-160KGRCT-ND <https://www.digikey.com/product-detail/en/yageo/RC0603JR-07160KL/311-160KGRCT-ND/729666>; POPULATE: YES; VERIFIED: NO
R82 R102 = openag-resistors:200K-RC0603JR-07200KL: Yageo - RC0603JR-07200KL - RES SMD 200K OHM 5% 1/10W 0603 Description: 200 kOhms �5% 0.1W, 1/10W Chip Resistor 0603 (1608 Metric) Moisture Resistant Thick Film Technical Specifications: Resistance: 200 kOhms Tolerance: �5% Power: 0.1W, 1/10W Temperature Coefficient: �100ppm/�C Operating Temperature: -55�C ~ 155�C Package / Case: 0603 (1608 Metric) Datasheet(s): RC Series, L Datasheet <http://www.yageo.com/documents/recent/PYu-RC_Group_51_RoHS_L_8.pdf> Vendor(s): Digikey: 311-200KGRCT-ND <https://www.digikey.com/product-detail/en/yageo/RC0603JR-07200KL/311-200KGRCT-ND/729685>; POPULATE: NO; VERIFIED: NO
R89 R103 = openag-resistors:6.3OHM-RC0805FR-076R34L: Yageo - RC0805FR-076R34L - RES SMD 6.34 OHM 1% 1/8W 0805 Description: 6.34 Ohms �1% 0.125W, 1/8W Chip Resistor 0805 (2012 Metric) Moisture Resistant Thick Film Technical Specifications: Resistance: 6.34 Ohms Tolerance: �1% Power: 0.125W, 1/8W Temperature Coefficient: �200ppm/�C Operating Temperature: -55�C ~ 155�C Packaging / Case: 0805 (2012 Metric) Datasheet(s): RC Series, L Datasheet Vendor(s): Digikey: 311-6.34CRCT-ND <https://www.digikey.com/product-detail/en/yageo/RC0805FR-076R34L/311-6.34CRCT-ND/731003>; POPULATE: YES; VERIFIED: NO
R90 R104 = openag-resistors:16.5K-311-16.5KHRCT-ND: Yageo - 311-16.5KHRCT-ND - RES SMD 16.5K OHM 1% 1/10W 0603 Description: 16.5 kOhms �1% 0.1W, 1/10W Chip Resistor 0603 (1608 Metric) Moisture Resistant Thick Film Technical Specifications: Resistance: 16.5 kOhms Tolerance: �1% Power: 0.1W, 1/10W Temperature Coefficient: �100ppm/�C Operating Temperature: -55�C ~ 155�C Package / Case: 0603 (1608 Metric) Datasheet(s): RC Series, L Datasheet <http://www.yageo.com/documents/recent/PYu-RC_Group_51_RoHS_L_8.pdf> Vendor(s): https://www.digikey.com/product-detail/en/yageo/RC0603FR-0716K5L/311-16.5KHRCT-ND/729916: 311-16.5KHRCT-ND <link to part>; POPULATE: YES; VERIFIED: NO
R100 = openag-resistors:51K-RC0603JR-0751KL: Yageo - RC0603JR-0751KL - RES SMD 51K OHM 5% 1/10W 0603 Description: 51 kOhms �5% 0.1W, 1/10W Chip Resistor 0603 (1608 Metric) Moisture Resistant Thick Film Technical Specifications: Resistance: 51 kOhms Tolerance: �5% Power: 0.1W, 1/10W Temperature Coefficient: �100ppm/�C Operating Temperature: -55�C ~ 155�C Package / Case: 0603 (1608 Metric) Datasheet(s): RC Series, L Datasheet <http://www.yageo.com/documents/recent/PYu-RC_Group_51_RoHS_L_7.pdf> Vendor(s): Digikey: 311-51KGRCT-ND <https://www.digikey.com/product-detail/en/yageo/RC0603JR-0751KL/311-51KGRCT-ND/729751>; POPULATE: YES; VALUE: 51K; VERIFIED: NO
RELAY_1-RELAY_10 = relay_2:G5LE-14_DC12; MANUFACTURER_PART_NUMBER: G5LE14 DC12; VENDOR: OMRON
RM3.33.3S1 RM3.33.3S3 RM3.33.3S4 RM3.33.3S6 = mranostay:ROE-0505S
SJ1 = SparkFun-Passives:JUMPER-PAD-3-NC_BY_TRACE
SJ12 = SparkFun-Passives:JUMPER-PAD-2-NC_BY_TRACE
U1 U2 = ULN2803:ULN2803ADWR; MANUFACTURER_PART_NUMBER: ULN2803ADWR; VENDOR: Vendor
U3 U4 = OpenAG_I2C:TCA9548APWR; MANUFACTURER_PART_NUMBER: TCA9548APWR; VENDOR: TEXAS INSTRUMENTS
U5 = SparkFun:RJ45-8: RJ45 Jack Simple RJ45, 8-pin connection - connector for common Cat5, Cat5e, and Cat6 Ethernet cables. Footprint not yet proven in production. Connector sku is PRT-00643; Breakout PCB sku is BOB-00716.
U6-U8 U11 = OpenAG_I2C:STD12NF06LT4; MANUFACTURER_PART_NUMBER: STD12NF06LT4; VENDOR: ST Microelectronics
U9 U12 = IO_Expander:PCF8574APWR; MANUFACTURER_PART_NUMBER: PCF8574APWR; VENDOR: Texas Instruments
U14 U17 = openag-regulators:MPM3620GQV-P: Monolithic Power Systems - MPM3620GQV-P - IC REG BUCK ADJ 2A SYNC 20QFN Technical Specifications: Type: Non-Isolated PoL Module Number of Outputs: 1 Input Voltage: 4.5V ~ 24V Output Voltage: 0.8V ~ 18.48V Max Current Output: 2A Operating Temperature: -40�C ~ 125�C Mounting Type: Surface Mount Package / Case: 20-PowerLFQFN Module Datasheet(s): MPM3620 Datasheet <http://www.monolithicpower.com/DesktopModules/DocumentManage/API/Document/getDocument?id=3021> Vendor(s): Digikey: 1589-1252-2-ND <https://www.digikey.com/product-detail/en/monolithic-power-systems-inc/MPM3620GQV-P/1589-1252-2-ND/5299009>; POPULATE: YES; VERIFIED: NO
U$2 U$3 U$5 U$33 = mranostay:BNC: BNC Connector, Mouser Part# 5227161
X1-X10 = Poitrast_LEDdynamics:MSTBA3: PHOENIX